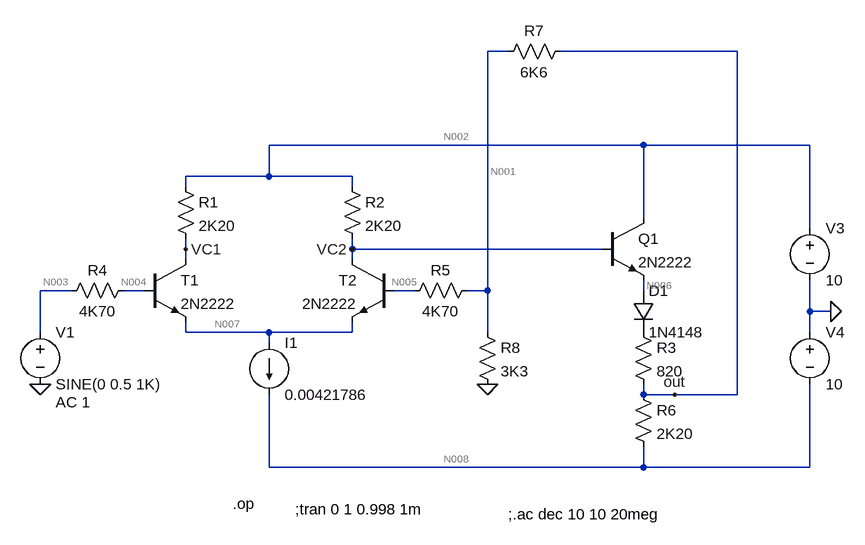
[diagram p0: schematic Prelab 3.asc]
Prelab 3.asc, the LTspice schematic file:
Version 4
SHEET 1 1144 680
WIRE 624 -192 592 -192
WIRE 976 -192 704 -192
WIRE 832 -48 256 -48
WIRE 1088 -48 832 -48
WIRE 256 0 256 -48
WIRE 256 0 128 0
WIRE 384 0 256 0
WIRE 128 16 128 0
WIRE 384 16 384 0
WIRE 832 64 832 -48
WIRE 1088 80 1088 -48
WIRE 128 112 128 96
WIRE 384 112 384 96
WIRE 768 112 384 112
WIRE 128 128 128 112
WIRE 384 128 384 112
WIRE -48 176 -96 176
WIRE 64 176 32 176
WIRE 480 176 448 176
WIRE 592 176 592 -192
WIRE 592 176 560 176
WIRE 832 176 832 160
WIRE 1088 208 1088 160
WIRE 1120 208 1088 208
WIRE -96 240 -96 176
WIRE 128 240 128 224
WIRE 256 240 128 240
WIRE 384 240 384 224
WIRE 384 240 256 240
WIRE 592 240 592 176
WIRE 1088 240 1088 208
WIRE 256 256 256 240
WIRE 832 336 832 320
WIRE 880 336 832 336
WIRE 976 336 976 -192
WIRE 976 336 880 336
WIRE 256 448 256 336
WIRE 832 448 832 416
WIRE 832 448 256 448
WIRE 1088 448 1088 320
WIRE 1088 448 832 448
FLAG -96 320 0
FLAG 592 320 0
FLAG 1120 208 0
FLAG 384 112 VC2
FLAG 128 112 VC1
FLAG 880 336 out
SYMBOL res 112 0 R0
SYMATTR InstName R1
SYMATTR Value 2K20
SYMBOL res 368 0 R0
SYMATTR InstName R2
SYMATTR Value 2K20
SYMBOL res 48 160 R90
WINDOW 0 0 56 VBottom 2
WINDOW 3 32 56 VTop 2
SYMATTR InstName R4
SYMATTR Value 4K70
SYMBOL res 576 160 R90
WINDOW 0 0 56 VBottom 2
WINDOW 3 32 56 VTop 2
SYMATTR InstName R5
SYMATTR Value 4K70
SYMBOL npn 64 128 R0
SYMATTR InstName T1
SYMATTR Value 2N2222
SYMBOL npn 448 128 M0
SYMATTR InstName T2
SYMATTR Value 2N2222
SYMBOL voltage -96 224 R0
WINDOW 123 24 124 Left 2
WINDOW 39 0 0 Left 0
SYMATTR Value2 AC 1
SYMATTR InstName V1
SYMATTR Value SINE(0 0.5 1K)
SYMBOL voltage 1088 64 R0
WINDOW 123 0 0 Left 0
WINDOW 39 0 0 Left 0
SYMATTR InstName V3
SYMATTR Value 10
SYMBOL voltage 1088 224 R0
WINDOW 123 0 0 Left 0
WINDOW 39 0 0 Left 0
SYMATTR InstName V4
SYMATTR Value 10
SYMBOL current 256 256 R0
WINDOW 123 0 0 Left 0
WINDOW 39 0 0 Left 0
SYMATTR InstName I1
SYMATTR Value 0.00421786
SYMBOL npn 768 64 R0
SYMATTR InstName Q1
SYMATTR Value 2N2222
SYMBOL diode 816 176 R0
SYMATTR InstName D1
SYMATTR Value 1N4148
SYMBOL res 816 224 R0
SYMATTR InstName R3
SYMATTR Value 820
SYMBOL res 816 320 R0
SYMATTR InstName R6
SYMATTR Value 2K20
SYMBOL res 720 -208 R90
WINDOW 0 0 56 VBottom 2
WINDOW 3 32 56 VTop 2
SYMATTR InstName R7
SYMATTR Value 6K6
SYMBOL res 576 224 R0
SYMATTR InstName R8
SYMATTR Value 3K3
TEXT 200 504 Left 2 !.op
TEXT 296 512 Left 2 !;tran 0 1 0.998 1m
TEXT 624 520 Left 2 !;.ac dec 10 10 20meg

The netlist it stands for:
* Prelab 3.asc
R1 N002 VC1 2K20
R2 N002 VC2 2K20
R4 N004 N003 4K70
R5 N001 N005 4K70
Q§T1 VC1 N004 N007 0 2N2222
Q§T2 VC2 N005 N007 0 2N2222
V1 N003 0 SINE(0 0.5 1K) AC 1
V3 N002 0 10
V4 0 N008 10
I1 N007 N008 0.00421786
Q1 N002 VC2 N006 0 2N2222
D1 N006 P001 1N4148
R3 P001 out 820
R6 out N008 2K20
R7 out N001 6K6
R8 N001 0 3K3
.model D D
.lib standard.dio
.model NPN NPN
.model PNP PNP
.lib standard.bjt
.op
;tran 0 1 0.998 1m
;.ac dec 10 10 20meg
.backanno
.end

* Results of the author's LTspice run, read from the files saved beside the schematic
* Operating Point:
*   V(n002) = 10 V
*   V(vc1) = 5.516 V
*   V(vc2) = 5.2 V
*   V(n004) = -45.66 mV
*   V(n003) = 0 V
*   V(n001) = 4.517 mV
*   V(n005) = -44.04 mV
*   V(n007) = -718.5 mV
*   V(n008) = -10 V
*   V(n006) = 4.505 V
*   V(p001) = 3.849 V
*   V(out) = 81.74 mV
*   Ic(Q1) = 4.572 mA
*   Ib(Q1) = 22.13 µA
*   Ie(Q1) = -4.594 mA
*   Ic(T2) = 2.16 mA
*   Ib(T2) = 10.33 µA
*   Ie(T2) = -2.17 mA
*   Ic(T1) = 2.038 mA
*   Ib(T1) = 9.715 µA
*   Ie(T1) = -2.048 mA
*   I(D1) = 4.594 mA
*   I(I1) = 4.218 mA
*   I(R8) = 1.369 µA
*   I(R7) = 11.7 µA
*   I(R6) = 4.583 mA
*   I(R3) = 4.594 mA
*   I(R5) = 10.33 µA
*   I(R4) = -9.715 µA
*   I(R2) = 2.182 mA
*   I(R1) = 2.038 mA
*   I(V4) = -8.8 mA
*   I(V3) = -8.792 mA
*   I(V1) = -9.715 µA
* From the log:
*   Semiconductor Device Operating Points:
*                           --- Diodes ---
*   Name:      d1
*   Model:   1n4148
*   Id:      4.59e-03
*   Vd:      6.56e-01
*   Req:     9.86e+00
*   CAP:     2.03e-09
*                           --- Bipolar Transistors ---
*   Name:       q1         q§t2        q§t1
*   Model:    2n2222      2n2222      2n2222
*   Ib:       2.21e-05    1.03e-05    9.72e-06
*   Ic:       4.57e-03    2.16e-03    2.04e-03
*   Vbe:      6.95e-01    6.74e-01    6.73e-01
*   Vbc:     -4.80e+00   -5.24e+00   -5.56e+00
*   Vce:      5.50e+00    5.92e+00    6.23e+00
*   BetaDC:   2.07e+02    2.09e+02    2.10e+02
*   Gm:       1.74e-01    8.29e-02    7.83e-02
*   Rpi:      1.17e+03    2.50e+03    2.66e+03
*   Rx:       1.00e+01    1.00e+01    1.00e+01
*   Ro:       2.29e+04    4.87e+04    5.18e+04
*   Cbe:      1.10e-10    7.29e-11    7.10e-11
*   Cbc:      4.13e-12    4.03e-12    3.96e-12
*   Cjs:      0.00e+00    0.00e+00    0.00e+00
*   BetaAC:   2.04e+02    2.08e+02    2.08e+02
*   Cbx:      0.00e+00    0.00e+00    0.00e+00
*   Ft:       2.43e+08    1.72e+08    1.66e+08